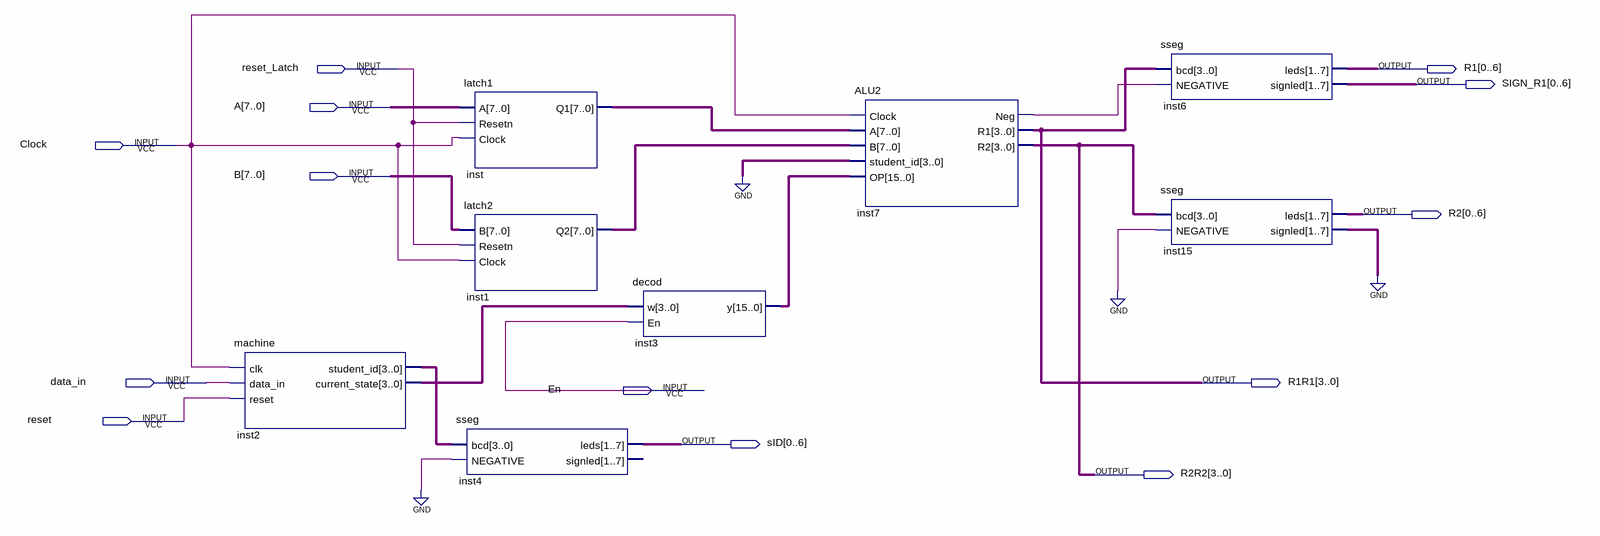
[diagram p0: schematic sheet]
// Quartus schematic ALU2Schematic.bdf as structural Verilog: 8 symbols, 13 pins
module ALU2Schematic (
  input  reset_Latch,
  input  [7:0] A,
  input  Clock,
  input  [7:0] B,
  input  data_in,
  input  En,
  input  reset,
  output [0:6] R1,
  output [0:6] SIGN_R1,
  output [0:6] R2,
  output [3:0] R1R1,
  output [0:6] sID,
  output [3:0] R2R2
);

  wire inst7_neg;
  wire [3:0] inst2_current_state, inst2_student_id;
  wire [6:0] inst15_signled;
  wire [7:0] inst1_q2, inst_q1;
  wire [15:0] inst3_y;

  machine inst2 (
    .clk(Clock), .data_in(data_in), .reset(reset), .student_id(inst2_student_id),
    .current_state(inst2_current_state));
  latch1 inst (.A(A), .Resetn(reset_Latch), .Clock(Clock), .Q1(inst_q1));
  latch2 inst1 (.B(B), .Resetn(reset_Latch), .Clock(Clock), .Q2(inst1_q2));
  sseg inst4 (.bcd(inst2_student_id), .NEGATIVE(1'b0), .leds(sID));  // open: signled
  decod inst3 (.w(inst2_current_state), .En(En), .y(inst3_y));
  ALU2 inst7 (
    .Clock(Clock), .A(inst_q1), .B(inst1_q2), .student_id(4'b0000), .OP(inst3_y), .Neg(inst7_neg), .R1(R1R1),
    .R2(R2R2));
  sseg inst6 (.bcd(R1R1), .NEGATIVE(inst7_neg), .leds(R1), .signled(SIGN_R1));
  sseg inst15 (.bcd(R2R2), .NEGATIVE(1'b0), .leds(R2), .signled(inst15_signled));
  // also tied to GND on the sheet: {inst15_signled[0], inst15_signled[1], inst15_signled[2], inst15_signled[3], inst15_signled[4], inst15_signled[5], inst15_signled[6]}
endmodule
